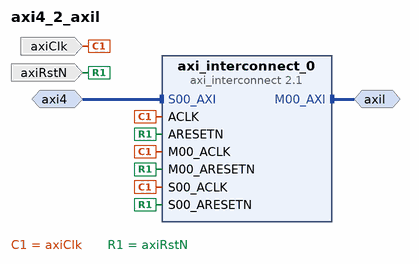
[diagram p0: block diagram of the top level]
# Vivado block design axi4_2_axil, xc7z010clg400-1, Vivado 2017.4
create_bd_design axi4_2_axil

create_bd_intf_port -mode Slave -vlnv xilinx.com:interface:aximm_rtl:1.0 axi4
set_property -dict [list \
  CONFIG.DATA_WIDTH 32 \
  CONFIG.PROTOCOL AXI4 \
  CONFIG.FREQ_HZ 156000000 \
  CONFIG.ID_WIDTH 12 \
  CONFIG.ADDR_WIDTH 32 \
  CONFIG.AWUSER_WIDTH 0 \
  CONFIG.ARUSER_WIDTH 0 \
  CONFIG.WUSER_WIDTH 0 \
  CONFIG.RUSER_WIDTH 0 \
  CONFIG.BUSER_WIDTH 0 \
  CONFIG.READ_WRITE_MODE READ_WRITE \
  CONFIG.HAS_BURST 1 \
  CONFIG.HAS_LOCK 1 \
  CONFIG.HAS_PROT 1 \
  CONFIG.HAS_CACHE 1 \
  CONFIG.HAS_QOS 1 \
  CONFIG.HAS_REGION 1 \
  CONFIG.HAS_WSTRB 1 \
  CONFIG.HAS_BRESP 1 \
  CONFIG.HAS_RRESP 1 \
  CONFIG.SUPPORTS_NARROW_BURST 1 \
  CONFIG.NUM_READ_OUTSTANDING 1 \
  CONFIG.NUM_WRITE_OUTSTANDING 1 \
  CONFIG.MAX_BURST_LENGTH 256 \
  CONFIG.NUM_READ_THREADS 1 \
  CONFIG.NUM_WRITE_THREADS 1 \
  CONFIG.RUSER_BITS_PER_BYTE 0 \
  CONFIG.WUSER_BITS_PER_BYTE 0 \
] [get_bd_intf_ports axi4]
create_bd_intf_port -mode Master -vlnv xilinx.com:interface:aximm_rtl:1.0 axil
set_property -dict [list \
  CONFIG.DATA_WIDTH 32 \
  CONFIG.PROTOCOL AXI4LITE \
  CONFIG.FREQ_HZ 156000000 \
  CONFIG.ADDR_WIDTH 32 \
  CONFIG.HAS_BURST 0 \
  CONFIG.HAS_LOCK 0 \
  CONFIG.HAS_PROT 0 \
  CONFIG.HAS_CACHE 0 \
  CONFIG.HAS_QOS 0 \
  CONFIG.HAS_REGION 0 \
] [get_bd_intf_ports axil]
create_bd_port -dir I -type clk axiClk
set_property -dict {CONFIG.FREQ_HZ 156000000 CONFIG.ASSOCIATED_RESET axiRstN} [get_bd_ports axiClk]
create_bd_port -dir I -type rst axiRstN
set_property -dict {CONFIG.POLARITY ACTIVE_LOW} [get_bd_ports axiRstN]

create_bd_cell -type ip -vlnv xilinx.com:ip:axi_interconnect:2.1 axi_interconnect_0
set_property -dict {CONFIG.NUM_MI 1} [get_bd_cells axi_interconnect_0]

# ---- connections ----

connect_bd_intf_net -intf_net axi4_1 [get_bd_intf_ports axi4] [get_bd_intf_pins axi_interconnect_0/S00_AXI]
connect_bd_intf_net [get_bd_intf_ports axil] [get_bd_intf_pins axi_interconnect_0/M00_AXI]
connect_bd_net [get_bd_ports axiClk] \
  [get_bd_pins axi_interconnect_0/ACLK] [get_bd_pins axi_interconnect_0/S00_ACLK] [get_bd_pins axi_interconnect_0/M00_ACLK]
connect_bd_net [get_bd_ports axiRstN] \
  [get_bd_pins axi_interconnect_0/ARESETN] [get_bd_pins axi_interconnect_0/S00_ARESETN] \
  [get_bd_pins axi_interconnect_0/M00_ARESETN]

# ---- address map ----
assign_bd_address -offset 0x00000000 -range 4G -target_address_space [get_bd_addr_spaces axi4] [get_bd_addr_segs axil/Reg]

validate_bd_design
save_bd_design
